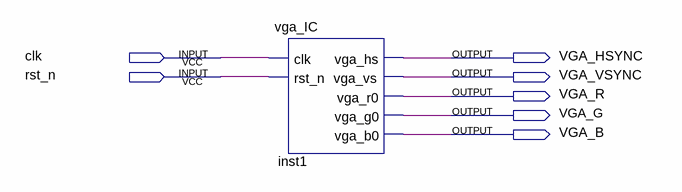
[diagram p0: schematic sheet]
// Quartus schematic vga.bdf as structural Verilog: 1 symbols, 7 pins
module vga (
  input  clk,
  input  rst_n,
  output VGA_HSYNC,
  output VGA_VSYNC,
  output VGA_R,
  output VGA_G,
  output VGA_B
);

  vga_IC inst1 (
    .clk(clk), .rst_n(rst_n), .vga_hs(VGA_HSYNC), .vga_vs(VGA_VSYNC), .vga_r0(VGA_R), .vga_g0(VGA_G),
    .vga_b0(VGA_B));
endmodule
